# EAGLE design MysensorsGW_huzzah (EAGLE 6.5.0)
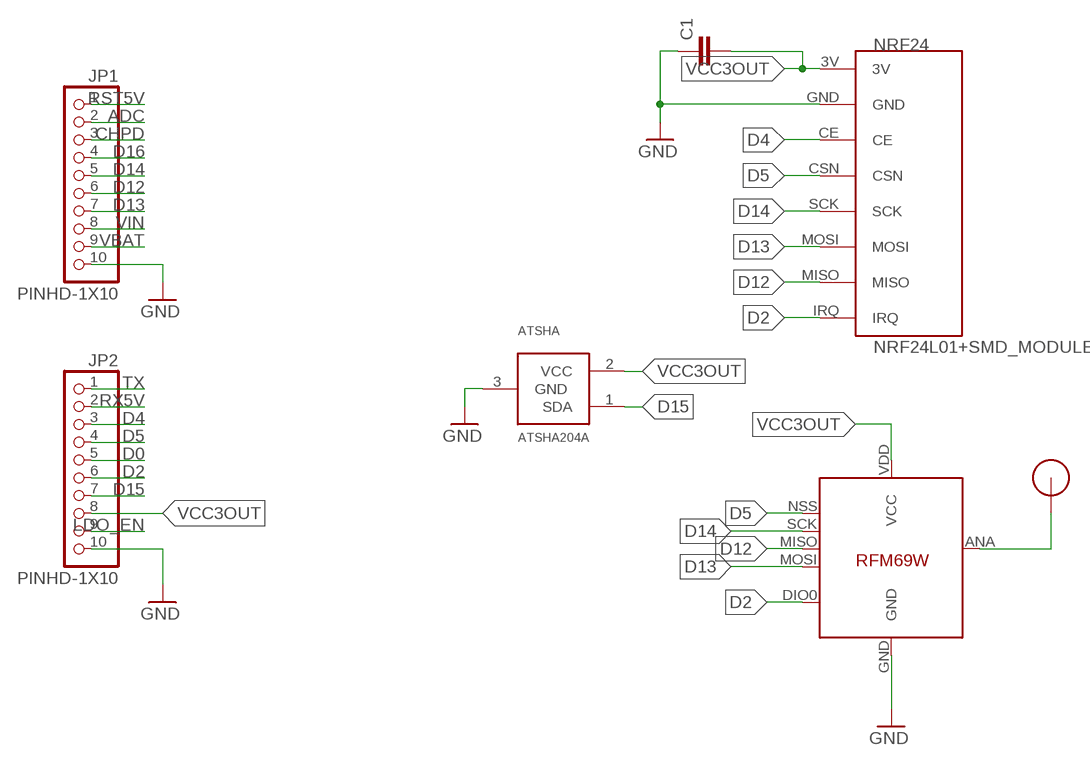
[diagram p0: schematic, sheet 1]

## Parts
ATSHA  ATSHA204A  [SOT23]
C1  CAP1206  [1206]
JP1  PINHD-1X10  [1X10-BIG]
JP2  PINHD-1X10  [1X10-BIG]
NRF24  NRF24L01+SMD_MODULE  [NRF24L01+SMD_MODULE]
RFM69  RFM69  [RFM69W-MINPADS]
U$2  RFM12B_ANTENNA  [RFM12B-ANTENNA]

## Nets
ADC: JP1.2
CHPD: JP1.3
D0: JP2.5
D2: JP2.6 NRF24.IRQ RFM69.DIO0
D4: JP2.3 NRF24.CE
D5: JP2.4 NRF24.CSN RFM69.NSS(SEL)
D12: JP1.6 NRF24.MISO RFM69.MISO
D13: JP1.7 NRF24.MOSI RFM69.MOSI
D14: JP1.5 NRF24.SCK RFM69.SCK
D15: ATSHA.1(SDA) JP2.7
D16: JP1.4
GND [Power]: ATSHA.3(GND) C1.1 JP1.10 JP2.10 NRF24.GND RFM69.GND
LDO_EN: JP2.9
N$1: RFM69.ANA(ANT) U$2.P$1
RST5V: JP1.1
RX5V: JP2.2
TX: JP2.1
VBAT: JP1.9
VCC3OUT: ATSHA.2(VCC) C1.2 JP2.8 NRF24.3V RFM69.VDD(VCC)
VIN: JP1.8

## Library data of the parts
ATSHA = Sensor_tbowmo:ATSHA204A
C1 = SparkFun-Passives:CAP: Capacitor Standard 0603 ceramic capacitor, and 0.1" leaded capacitor.
JP1 JP2 = adafruit:PINHD-1X10: Pin header 1x10 0.1" spacing With round pins
NRF24 = pmo_lib:NRF24L01+SMD_MODULE
RFM69 = LowPowerLab:RFM69
U$2 = LowPowerLab:RFM12B_ANTENNA

## Net classes
1 Power: width 0.406 mm

## Board
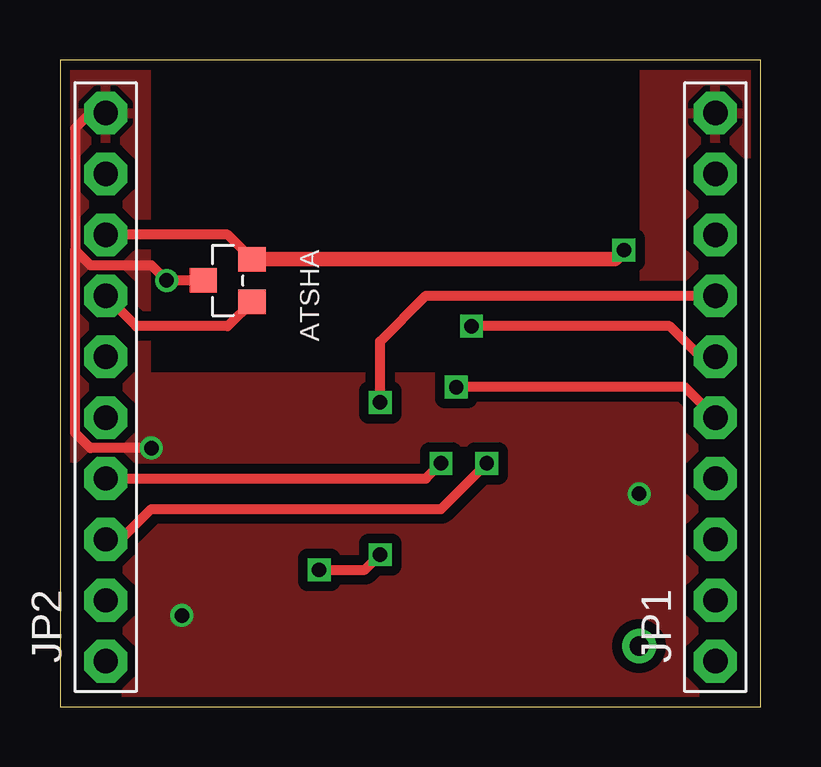
[diagram p1: board, top side]
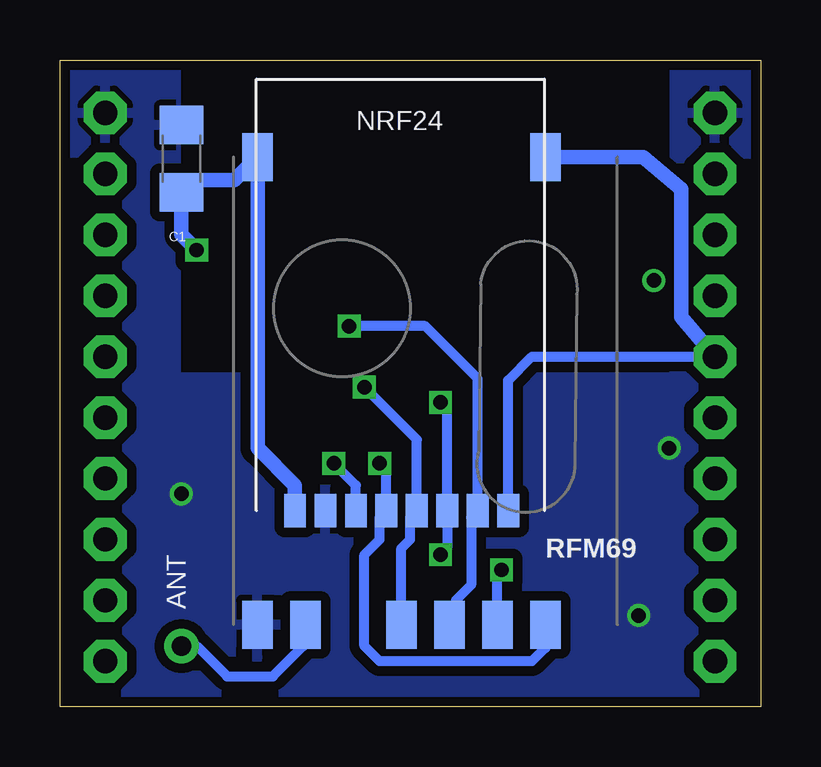
[diagram p2: board, bottom side, seen from below]

Size 29.19 x 26.98 mm. Coordinates in mm from the lower left corner, seen from the top.
Outline: 0,0 29.19,0 29.19,26.98 0,26.98 0,0
Copper layers (1*16): Top 0.0356mm / dielectric 1.5011mm / Bottom 0.0356mm
Design rules "LaenPCBOrder": minimum track width 6mil, minimum drill 13mil, track to track 6mil, track to pad 6mil, pad to pad 6mil, via to via 6mil, smd to smd 6mil, copper to edge 15mil, drill to drill 6mil, minimum pad ring 7mil, minimum via ring 7mil, stop-mask expansion 3mil, vias tented up to drill 0mil, thermal gap 10mil

### Footprints (pad centres in the part's own frame; a part is rotated, then mirrored left to right if it is on the bottom)
SOT23 = smd 1.016 x 1.143: 1 -0.889,-1.016; 2 0.889,-1.016; 3 0,1.016
1206 = smd 1.6 x 1.8: 1 -1.4,0; 2 1.4,0
1X10-BIG = drill 1.016 pad 1.778 octagon: 1 -11.43,0; 2 -8.89,0; 3 -6.35,0; 4 -3.81,0; 5 -1.27,0; 6 1.27,0; 7 3.81,0; 8 6.35,0; 9 8.89,0; 10 11.43,0
NRF24L01+SMD_MODULE = smd 0.9 x 1.4: 3V -4.8,-9.6; CE -2.26,-9.6; CSN -0.99,-9.6; GND -3.53,-9.6; IRQ 4.09,-9.6; MISO 2.82,-9.6; MOSI 1.55,-9.6; SCK 0.28,-9.6
RFM69W-MINPADS = smd 2 x 1.27: ANA 8,-5; DIO0 -11.5,5; GND 8,-7; MISO 8,1; MOSI 8,3; NSS 8,5; SCK 8,-1; VDD -11.5,-7
RFM12B-ANTENNA = drill 0.8 pad 1.422: P$1 0,0

### Placement (x,y rotation side)
ATSHA  6.99,17.78 90 top
C1  24.13,22.86 270 bottom
JP1  27.3,13.34 90 top
JP2  1.91,13.34 90 top
NRF24  14.61,17.78 0 bottom
RFM69  13.97,11.43 270 bottom
U$2  24.13,2.54 0 top

### Tracks (layer width: path | path; a pad name or v marks a point on that pad's centre or on a via)
D2
  Bottom 0.406: NRF24.IRQ 10.52,13.62 9.53,14.61 JP2.6
  Bottom 0.61: RFM69.DIO0 4.9,22.93 3.3,21.59 3.3,16.26 JP2.6
D4  (via drill 0.6)
  Top 0.406: JP2.3 2.54,6.99 3.81,8.26 15.88,8.26 v17.78,10.16
  Bottom 0.406: NRF24.CE 16.86,9.24 v17.78,10.16
D5  (via drill 0.6)
  Top 0.406: JP2.4 15.24,9.53 v15.88,10.16
  Bottom 0.406: v15.88,10.16 15.6,9.88 NRF24.CSN 15.88,7.9 15.88,6.99 16.51,6.35 16.51,2.54 15.88,1.91 9.53,1.91 8.97,2.46 RFM69.NSS
D12  (via drill 0.6)
  Top 0.406: JP1.6 26.67,14.61 25.4,15.88 v17.14,15.88
  Bottom 0.406: RFM69.MISO 12.7,3.7 12.7,4.45 12.06,5.08 12.06,7.9 NRF24.MISO 11.79,13.69 13.97,15.88 v17.14,15.88
D13  (via drill 0.6)
  Top 0.406: v13.34,12.7 13.34,15.24 15.24,17.14 JP1.7 | v10.79,5.71 12.7,5.71 v13.34,6.35
  Bottom 0.406: v13.34,12.7 13.05,12.42 NRF24.MOSI 13.05,6.63 v13.34,6.35 | RFM69.MOSI 10.97,5.54 v10.79,5.71
D14  (via drill 0.6)
  Top 0.406: JP1.5 26.04,13.34 v16.51,13.34
  Bottom 0.406: RFM69.SCK 14.97,6.62 14.61,6.99 14.61,7.9 NRF24.SCK 14.32,11.15 v16.51,13.34
D15
  Top 0.406: ATSHA.1 6.99,15.88 3.17,15.88 JP2.7
GND  (via drill 0.6)
  Top 0.406: JP2.10 1.27,24.77 0.64,24.13 0.64,19.05 | 0.64,19.05 1.27,18.41 3.81,18.41 v4.45,17.78 ATSHA.3 | v3.81,10.79 1.27,10.79 0.64,11.43 0.64,19.05
  other vias: 24.13,8.89 5.08,3.81
  pour Bottom (isolate 0.406): -7.62,36.83 35.56,36.83 35.56,-3.81 -7.62,-3.81
  pour Top (isolate 0.406): -6.35,34.29 33.02,34.29 33.02,-2.54 -6.35,-2.54
N$1
  Bottom 0.406: U$2.P$1 23.5,2.54 22.23,1.27 20.32,1.27 19.05,2.54 19.05,3.35 RFM69.ANA
N$2
  cutout Top: 3.81,26.67 24.13,26.67 24.13,13.97 3.81,13.97
N$3
  cutout Bottom: 3.81,26.67 24.13,26.67 24.13,13.97 3.81,13.97
VCC3OUT  (via drill 0.6)
  Top 0.406: ATSHA.2 6.99,19.68 JP2.8
  Top 0.61: ATSHA.2 23.11,18.67 v23.5,19.05
  Bottom 0.406: RFM69.VDD 21.32,22.59 20.95,22.23 | NRF24.3V 19.41,8.61 | 23.63,21.96 C1.2
  Bottom 0.61: 19.41,8.61 19.41,9.24 20.95,10.79 20.95,22.23 | 23.63,21.96 21.94,21.96 21.32,22.59 | C1.2 24.13,19.68 v23.5,19.05

### Text on the board
bPlace: ANT